# EAGLE schematic MegaShield v0.1 (EAGLE 6.4)
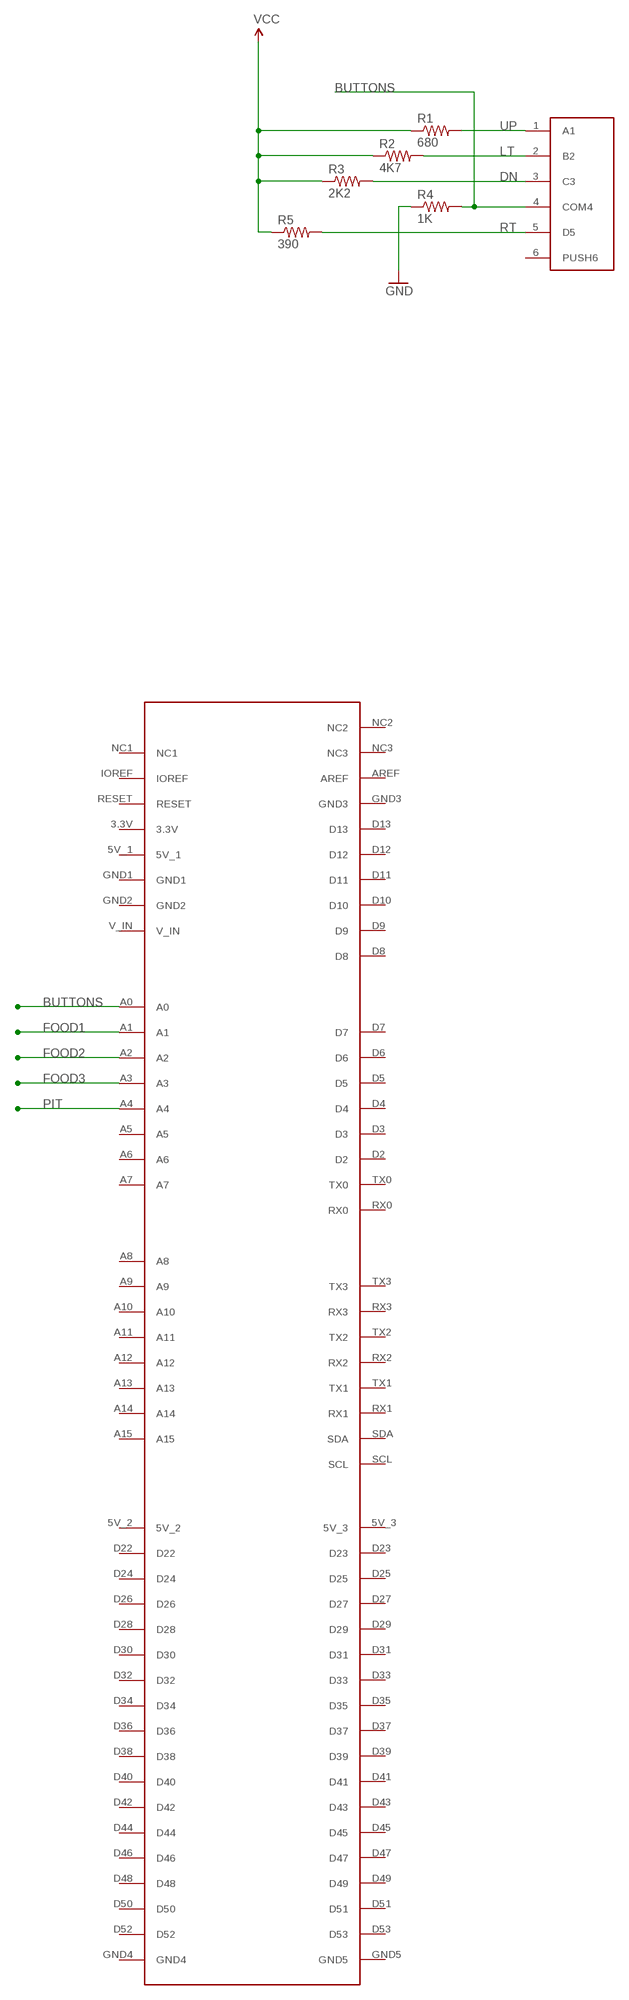
[diagram p0: schematic, sheet 1]

## Parts
R1  680  RESISTOR1206  [1206]
R2  4K7  RESISTOR1206  [1206]
R3  2K2  RESISTOR1206  [1206]
R4  1K  RESISTOR1206  [1206]
R5  390  RESISTOR1206  [1206]
U$1  MEGASHILED  [MEGASHIELD]
U$2  SKQUAAA010  [SKQUAAA010]

## Nets
BUTTONS: R4.2 U$1.A0 U$2.4(COM4)
DN: R3.2 U$2.3(C3)
FOOD1: U$1.A1
FOOD2: U$1.A2
FOOD3: U$1.A3
GND: R4.1
LT: R2.2 U$2.2(B2)
PIT: U$1.A4
RT: R5.2 U$2.5(D5)
UP: R1.2 U$2.1(A1)
VCC: R1.1 R2.1 R3.1 R5.1
Unconnected: U$1.3.3V U$1.5V_1 U$1.5V_2 U$1.5V_3 U$1.A5 U$1.A6 U$1.A7 U$1.A8 U$1.A9 U$1.A10 U$1.A11 U$1.A12 U$1.A13 U$1.A14 U$1.A15 U$1.AREF U$1.D2 U$1.D3 U$1.D4 U$1.D5 U$1.D6 U$1.D7 U$1.D8 U$1.D9 U$1.D10 U$1.D11 U$1.D12 U$1.D13 U$1.D22 U$1.D23 U$1.D24 U$1.D25 U$1.D26 U$1.D27 U$1.D28 U$1.D29 U$1.D30 U$1.D31 U$1.D32 U$1.D33 U$1.D34 U$1.D35 U$1.D36 U$1.D37 U$1.D38 U$1.D39 U$1.D40 U$1.D41 U$1.D42 U$1.D43 U$1.D44 U$1.D45 U$1.D46 U$1.D47 U$1.D48 U$1.D49 U$1.D50 U$1.D51 U$1.D52 U$1.D53 U$1.GND1 U$1.GND2 U$1.GND3 U$1.GND4 U$1.GND5 U$1.IOREF U$1.NC1 U$1.NC2 U$1.NC3 U$1.RESET U$1.RX0 U$1.RX1 U$1.RX2 U$1.RX3 U$1.SCL U$1.SDA U$1.TX0 U$1.TX1 U$1.TX2 U$1.TX3 U$1.V_IN U$2.6(PUSH6)

## Library data of the parts
R1-R5 = SparkFun-Passives:RESISTOR: Resistor Basic schematic elements and footprints for 0603, 1206, and PTH resistors.
U$1 = Arduino:MEGASHILED
U$2 = MyLib:SKQUAAA010